# Altium schematic sheet IO Connections.SchDoc
size A4
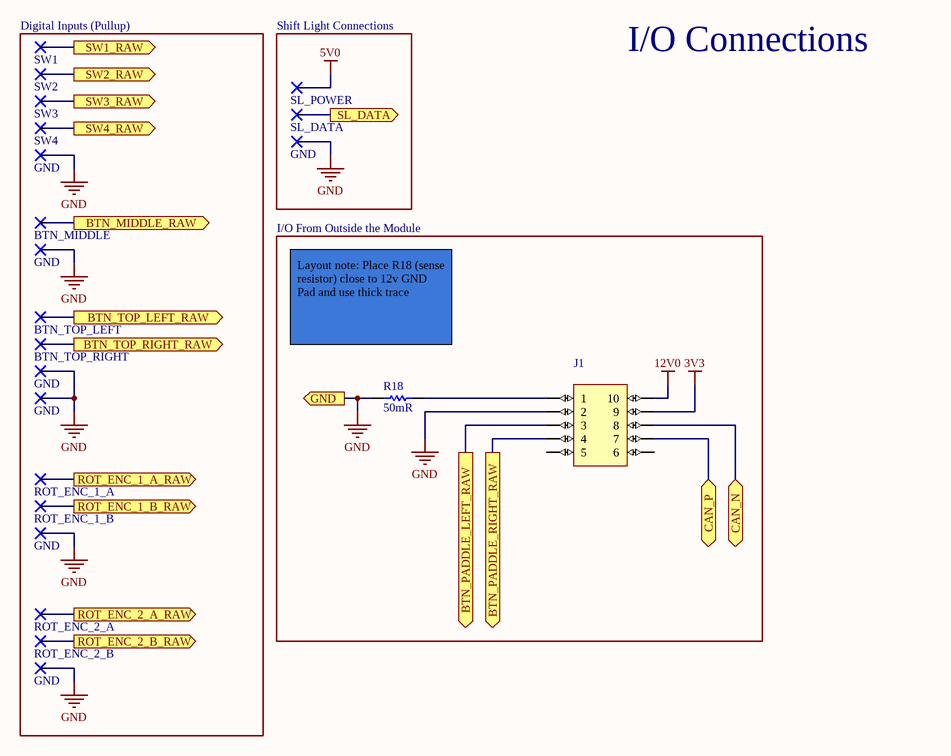
[diagram p0: IO Connections.SchDoc]

## Parts
(Parts that share a designator on the sheet are numbered #1, #2 ... from top to bottom, then left to right.)
BTN_MIDDLE  Rectangular  [2.5x5mm]  (value not drawn)
BTN_TOP_LEFT  Rectangular  [2.5x5mm]  (value not drawn)
BTN_TOP_RIGHT  Rectangular  [2.5x5mm]  (value not drawn)
GND#1  Rectangular  [2.5x5mm]  (value not drawn)
GND#2  Rectangular  [2.5x5mm]  (value not drawn)
GND#3  Rectangular  [2.5x5mm]  (value not drawn)
GND#4  Rectangular  [2.5x5mm]  (value not drawn)
GND#5  Rectangular  [2.5x5mm]  (value not drawn)
GND#6  Rectangular  [2.5x5mm]  (value not drawn)
GND#7  Rectangular  [2.5x5mm]  (value not drawn)
J1  DF37NB-10DS-0.4V(51)  [DF37NB-10DS-0.4V(51)]  (value not drawn)
R18  50mR  [RESC2013X70X40ML20T20]
ROT_ENC_1_A  Rectangular  [2.5x5mm]  (value not drawn)
ROT_ENC_1_B  Rectangular  [2.5x5mm]  (value not drawn)
ROT_ENC_2_A  Rectangular  [2.5x5mm]  (value not drawn)
ROT_ENC_2_B  Rectangular  [2.5x5mm]  (value not drawn)
SL_DATA  Rectangular  [2.5x5mm]  (value not drawn)
SL_POWER  Rectangular  [2.5x5mm]  (value not drawn)
SW1  Rectangular  [2.5x5mm]  (value not drawn)
SW2  Rectangular  [2.5x5mm]  (value not drawn)
SW3  Rectangular  [2.5x5mm]  (value not drawn)
SW4  Rectangular  [2.5x5mm]  (value not drawn)

## Blocks framed on the sheet
Digital Inputs (Pullup): BTN_MIDDLE BTN_TOP_LEFT BTN_TOP_RIGHT GND#2-GND#7 ROT_ENC_1_A ROT_ENC_1_B ROT_ENC_2_A ROT_ENC_2_B SW1-SW4
Shift Light Connections: GND#1 SL_DATA SL_POWER
I/O From Outside the Module: J1 R18

## Ports
BTN_MIDDLE_RAW (out), BTN_PADDLE_LEFT_RAW (out), BTN_PADDLE_RIGHT_RAW (out), BTN_TOP_LEFT_RAW (out), BTN_TOP_RIGHT_RAW (out), CAN_N (bidir), CAN_P (bidir), GND (out), ROT_ENC_1_A_RAW (out), ROT_ENC_1_B_RAW (out), ROT_ENC_2_A_RAW (out), ROT_ENC_2_B_RAW (out), SL_DATA (out), SW1_RAW (out), SW2_RAW (out), SW3_RAW (out), SW4_RAW (out)

## Nets
3V3: J1.9
5V0: SL_POWER.1
12V0: J1.10
GND: GND#1.1 GND#2.1 GND#3.1 GND#4.1 GND#5.1 GND#6.1 GND#7.1 J1.2 R18.2 ; port GND
BTN_MIDDLE_RAW: BTN_MIDDLE.1 ; port BTN_MIDDLE_RAW
BTN_PADDLE_LEFT_RAW: J1.3 ; port BTN_PADDLE_LEFT_RAW
BTN_PADDLE_RIGHT_RAW: J1.4 ; port BTN_PADDLE_RIGHT_RAW
BTN_TOP_LEFT_RAW: BTN_TOP_LEFT.1 ; port BTN_TOP_LEFT_RAW
BTN_TOP_RIGHT_RAW: BTN_TOP_RIGHT.1 ; port BTN_TOP_RIGHT_RAW
CAN_N: J1.8 ; port CAN_N
CAN_P: J1.7 ; port CAN_P
ROT_ENC_1_A_RAW: ROT_ENC_1_A.1 ; port ROT_ENC_1_A_RAW
ROT_ENC_1_B_RAW: ROT_ENC_1_B.1 ; port ROT_ENC_1_B_RAW
ROT_ENC_2_A_RAW: ROT_ENC_2_A.1 ; port ROT_ENC_2_A_RAW
ROT_ENC_2_B_RAW: ROT_ENC_2_B.1 ; port ROT_ENC_2_B_RAW
SL_DATA: SL_DATA.1 ; port SL_DATA
SW1_RAW: SW1.1 ; port SW1_RAW
SW2_RAW: SW2.1 ; port SW2_RAW
SW3_RAW: SW3.1 ; port SW3_RAW
SW4_RAW: SW4.1 ; port SW4_RAW
NetJ1_1: J1.1 R18.1

Not connected (* = marked no-connect by the designer): J1 5 6

## Notes on the sheet
- I/O Connections
- Layout note: Place R18 (sense resistor) close to 12v GND Pad and use thick trace

## Library data of the parts
R18 = CMP-2001-00474-1: Part Number: ERJ-L06KF50MV; Manufacturer: Panasonic; Tolerance: 1%; Temperature Coefficient: 100ppm/°C; Power Rating: 125mW; Supplier 1: LCSC; Supplier Part Number 1: C713441; Manufacturer Part Number: ERJ-L06KF50MV; RoHS: Yes; Category: Chip SMD Resistors; Stock 1: 1602; Pricing 1: 1=0.28710, 10=0.22250, 30=0.21080, 100=0.19890, 500=0.19370, 1000=0.19100, 1=0.28400, 10=0.22010, 30=0.20850, 100=0.19670, 500=0.19160, 1000=0.18890, 1=1.45390, 10=1.12680, 30=1.06730, 100=1.00720, 500=0.98070, 1000=0.96710, 1=1.38320, 10=1.07200, 30=1.01540, 100=0.95820, 500=0.93300, 1000=0.92010, 1=0.18600, 10=0.14410, 30=0.13650, 100=0.12880, 500=0.12540, 1000=0.12370, 1=0.16100, 10=0.12480, 30=0.11820, 100=0.11150, 500=0.10860, 1000=0.10710, 1=1.74480, 10=1.35220, 30=1.28090, 100=1.20870, 500=1.17690, 1000=1.16060, 1=24.02270, 10=18.61790, 30=17.63520, 100=16.64180, 500=16.20380, 1000=15.97950, 1=0.91130, 10=0.70630, 30=0.66900, 100=0.63130, 500=0.61470, 1000=0.60620, 1=16.60260, 10=12.86720, 30=12.18800, 100=11.50150, 500=11.19880, 1000=11.04380, 1=1.88450, 10=1.46050, 30=1.38340, 100=1.30550, 500=1.27120, 1000=1.25360, 1=0.29900, 10=0.23170, 30=0.21950, 100=0.20710, 500=0.20170, 1000=0.19890, 1=0.22490, 10=0.17430, 30=0.16510, 100=0.15580, 500=0.15170, 1000=0.14960 (AUD); Mount: Surface Mount; Case/Package: 0805; Number of Pins: 2; Case Code (Metric): 2012; Case Code (Imperial): 0805; Weight: 0.000194oz; Contact Plating: Tin; Size Code: 0805; Min Operating Temperature: -55°C; Max Operating Temperature: 125°C; Resistance: 50mR; Packaging: Tape and Reel; Termination: SMD/SMT; Resistor Type: Thick Film; Package Quantity: 5000; Number of Terminations: 2; Max Power Dissipation: 125mW; Series: ERJL06; Resistance Tolerance: 1%; Technology: THICK FILM; Construction: Rectangular; Length: 2mm; Width: 0.049inch; Height: 0.6mm; Depth: 1.25mm; Radiation Hardening: No; Lead Free: Lead Free; REACH SVHC: No SVHC; RoHS Compliant: Yes; Military Standard: Not; ComponentLink1URL: https://datasheet.ciiva.com/11810/0900766b80befbf5-11810223.pdf?src-supplier=RSComponents; ComponentLink1Description: https://datasheet.ciiva.com/11810/0900766b80befbf5-11810223.pdf?src-supplier=RSComponents; ComponentLink2URL: https://datasheet.ciiva.com/30069/6aoa0000ce3-30069912.pdf?src-supplier=Onlinecomponents.com; ComponentLink2Description: https://datasheet.ciiva.com/30069/6aoa0000ce3-30069912.pdf?src-supplier=Onlinecomponents.com; ComponentLink3URL: https://datasheet.ciiva.com/16756/70068852-16756394.pdf?src-supplier=Allied+Electronics; ComponentLink3Description: https://datasheet.ciiva.com/16756/70068852-16756394.pdf?src-supplier=Allied+Electronics; ComponentLink4URL: https://datasheet.ciiva.com/48540/erj-eng-tds-48540666.pdf?src-supplier=Distrelec; ComponentLink4Description: https://datasheet.ciiva.com/48540/erj-eng-tds-48540666.pdf?src-supplier=Distrelec; ComponentLink5URL: https://datasheet.ciiva.com/9189/aoa0000ce3-9189051.pdf?src-supplier=Avnet; ComponentLink5Description: https://datasheet.ciiva.com/9189/aoa0000ce3-9189051.pdf?src-supplier=Avnet; ComponentLink6URL: https://datasheet.ciiva.com/16212/aoa0000ce3-16212043.pdf?src-supplier=Future+Electronics; ComponentLink6Description: https://datasheet.ciiva.com/16212/aoa0000ce3-16212043.pdf?src-supplier=Future+Electronics; ComponentLink7URL: https://datasheet.ciiva.com/16768/70068852-16768507.pdf?src-supplier=Allied+Electronics; ComponentLink7Description: https://datasheet.ciiva.com/16768/70068852-16768507.pdf?src-supplier=Allied+Electronics; ComponentLink8URL: https://datasheet.ciiva.com/46438/39793-46438155.pdf?src-supplier=Element14; ComponentLink8Description: https://datasheet.ciiva.com/46438/39793-46438155.pdf?src-supplier=Element14; ComponentLink9URL: https://datasheet.ciiva.com/46438/39793-46438156.pdf?src-supplier=Element14; ComponentLink9Description: https://datasheet.ciiva.com/46438/39793-46438156.pdf?src-supplier=Element14; ComponentLink10URL: https://datasheet.ciiva.com/24159/aoa0000ce3-72189-24159535.pdf?src-supplier=Mouser; ComponentLink10Description: https://datasheet.ciiva.com/24159/aoa0000ce3-72189-24159535.pdf?src-supplier=Mouser; ComponentLink11URL: https://datasheet.ciiva.com/16770/70068852-16770518.pdf?src-supplier=Allied+Electronics; ComponentLink11Description: https://datasheet.ciiva.com/16770/70068852-16770518.pdf?src-supplier=Allied+Electronics; ComponentLink12URL: https://datasheet.ciiva.com/17209/aoa0000ce3-17209448.pdf?src-supplier=Avnet+Europe; ComponentLink12Description: https://datasheet.ciiva.com/17209/aoa0000ce3-17209448.pdf?src-supplier=Avnet+Europe; Supplier 2: Digi-Key; Supplier Part Number 2: P50LLCT-ND; Stock 2: 9842; Pricing 2: 1=0.61000, 10=0.46600, 25=0.35480, 50=0.26360, 100=0.19600, 250=0.16560, 500=0.14196, 1000=0.10816 (USD)